# Altium schematic sheet Peripherals.SchDoc
size A
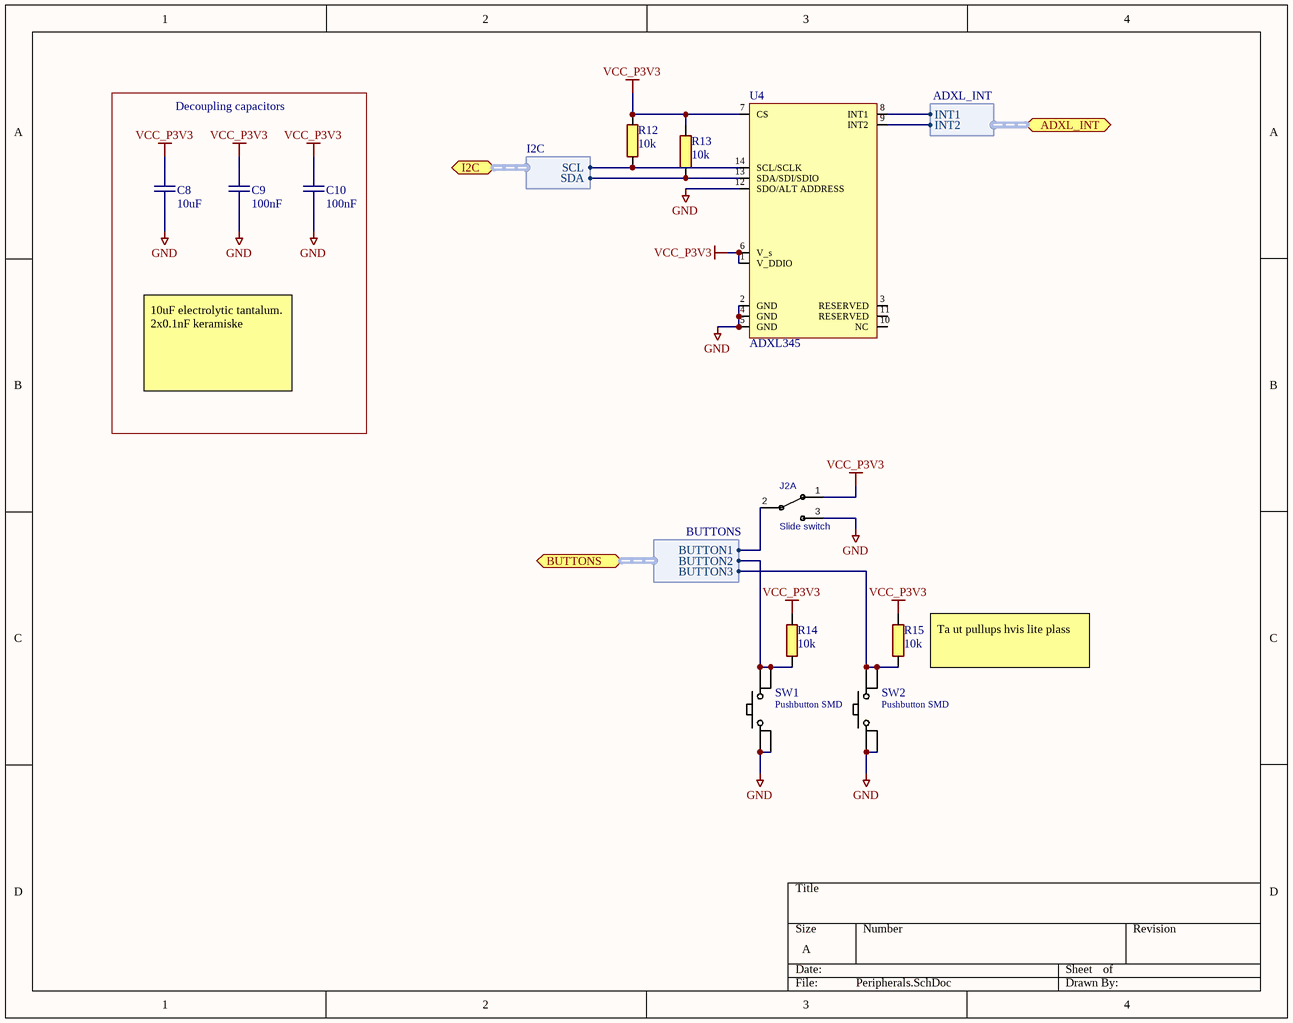
[diagram p0: Peripherals.SchDoc]

## Parts
C8  10uF  [CAPC1206(3216)170_N]
C9  100nF  [CAPC0603(1608)55_N]
C10  100nF  [CAPC0603(1608)55_N]
J2  Slide switch  [OS202011MA0QS1]  (part A of 2)
R12  10k  [RESC0603(1608)_N]
R13  10k  [RESC0603(1608)_N]
R14  10k  [RESC0603(1608)_N]
R15  10k  [RESC0603(1608)_N]
SW1  Pushbutton SMD  [SOIC254P500X160-4]
SW2  Pushbutton SMD  [SOIC254P500X160-4]
U4  ADXL345

## Blocks framed on the sheet
Decoupling capacitors: C8-C10

## Ports
ADXL_INT (harness ADXL_INT), BUTTONS (harness BUTTONS), I2C (harness I2C)

## Harnesses
I2C: SCL, SDA
BUTTONS: BUTTON1, BUTTON2, BUTTON3
ADXL_INT: INT1, INT2

## Nets
GND: C8.1 C9.1 C10.1 J2.3 SW1.1 SW1.2 SW2.1 SW2.2 U4.2(GND) U4.4(GND) U4.5(GND) U4.12(SDO/ALT_ADDRESS)
VCC_P3V3: C8.2 C9.2 C10.2 J2.1 R12.2 R13.2 R14.2 R15.2 U4.1(V_DDIO) U4.6(V_s) U4.7(CS)
NetJ2_2: J2.2 ; port BUTTONS.BUTTON1
NetR12_1: R12.1 U4.14(SCL/SCLK) ; port I2C.SCL
NetR13_1: R13.1 U4.13(SDA/SDI/SDIO) ; port I2C.SDA
NetR14_1: R14.1 SW1.3 SW1.4 ; port BUTTONS.BUTTON2
NetR15_1: R15.1 SW2.3 SW2.4 ; port BUTTONS.BUTTON3
NetU4_8: U4.8(INT1) ; port ADXL_INT.INT1
NetU4_9: U4.9(INT2) ; port ADXL_INT.INT2

Not connected (* = marked no-connect by the designer): U4 3(RESERVED) 10(NC) 11(RESERVED)

## Notes on the sheet
- 10uF electrolytic tantalum.
  2x0.1nF keramiske
- (near R15) Ta ut pullups hvis lite plass

## Library data of the parts
C8 = 3583: X5R 50V 10%; id: 3583; pakke_opprettet_av: 815; leverandor_varenr: 1845762; pris: 6; nokkelord: Kondensator, capacitor; produsent: Murata; leverandor: Farnell; pakketype: 1206; pakke_opprettet: 11-Feb-15 1:21:22 PM; symbol_opprettet_av: 815; symbol_opprettet: 14-Nov-14 8:19:34 PM; navn: 10uF
C9 C10 = 3028: X7R 50V 5%; id: 3028; pakke_opprettet_av: 815; leverandor_varenr: 1759122; pris: 1; nokkelord: Kondensator, Capacitor, CAP; produsent: Multikomp; leverandor: Farnell; pakketype: 0603; pakke_opprettet: 18-Feb-15 2:18:13 PM; symbol_opprettet_av: 815; symbol_opprettet: 14-Nov-14 8:19:34 PM; navn: 100nF
J2 = 4031: Vinklet; id: 4031; pakke_opprettet_av: 1335; leverandor_varenr: 2435101; navn: Bryter DPDT; pris: 0; nokkelord: right angle slide switch; leverandor: Farnell; pakketype: TH; pakke_opprettet: 20-Feb-17 6:08:34 PM; symbol_opprettet_av: 1335; symbol_opprettet: 20-Feb-17 6:08:19 PM
R12-R15 = 2444: 0.1W 1% Thick film resistor; id: 2444; rad: -1; rom: OV; lager_type: Fremlager; dybde: 72; hylle: 6; antall: 90; kolonne: 0; pakke_opprettet_av: 815; leverandor_varenr: 2447230; nokkelord: Resistor Motstand; produsent: Multikomp; leverandor: Farnell; pakketype: 0603; pakke_opprettet: 08-Jul-14 9:15:30 PM; symbol_opprettet_av: 815; symbol_opprettet: 08-Jul-14 9:16:33 PM; navn: 10k; pris: 0
SW1 SW2 = 2413: id: 2413; rad: 5; rom: OV; lager_type: Fremlager; dybde: 1; hylle: 6; antall: 100; pakke_opprettet_av: 815; beskrivelse: Momentary tactile pushbutton SMD; pris: 2; nokkelord: smd, tactile, pushbutton, knapp, smd; kolonne: 1; pakke_opprettet: 14-Nov-14 10:12:31 PM; symbol_opprettet_av: 815; symbol_opprettet: 14-Nov-14 9:57:30 PM; navn: Pushbutton SMD; pakketype: SMD